# Altium project pca63557.PrjPCB (part 1 of 2)
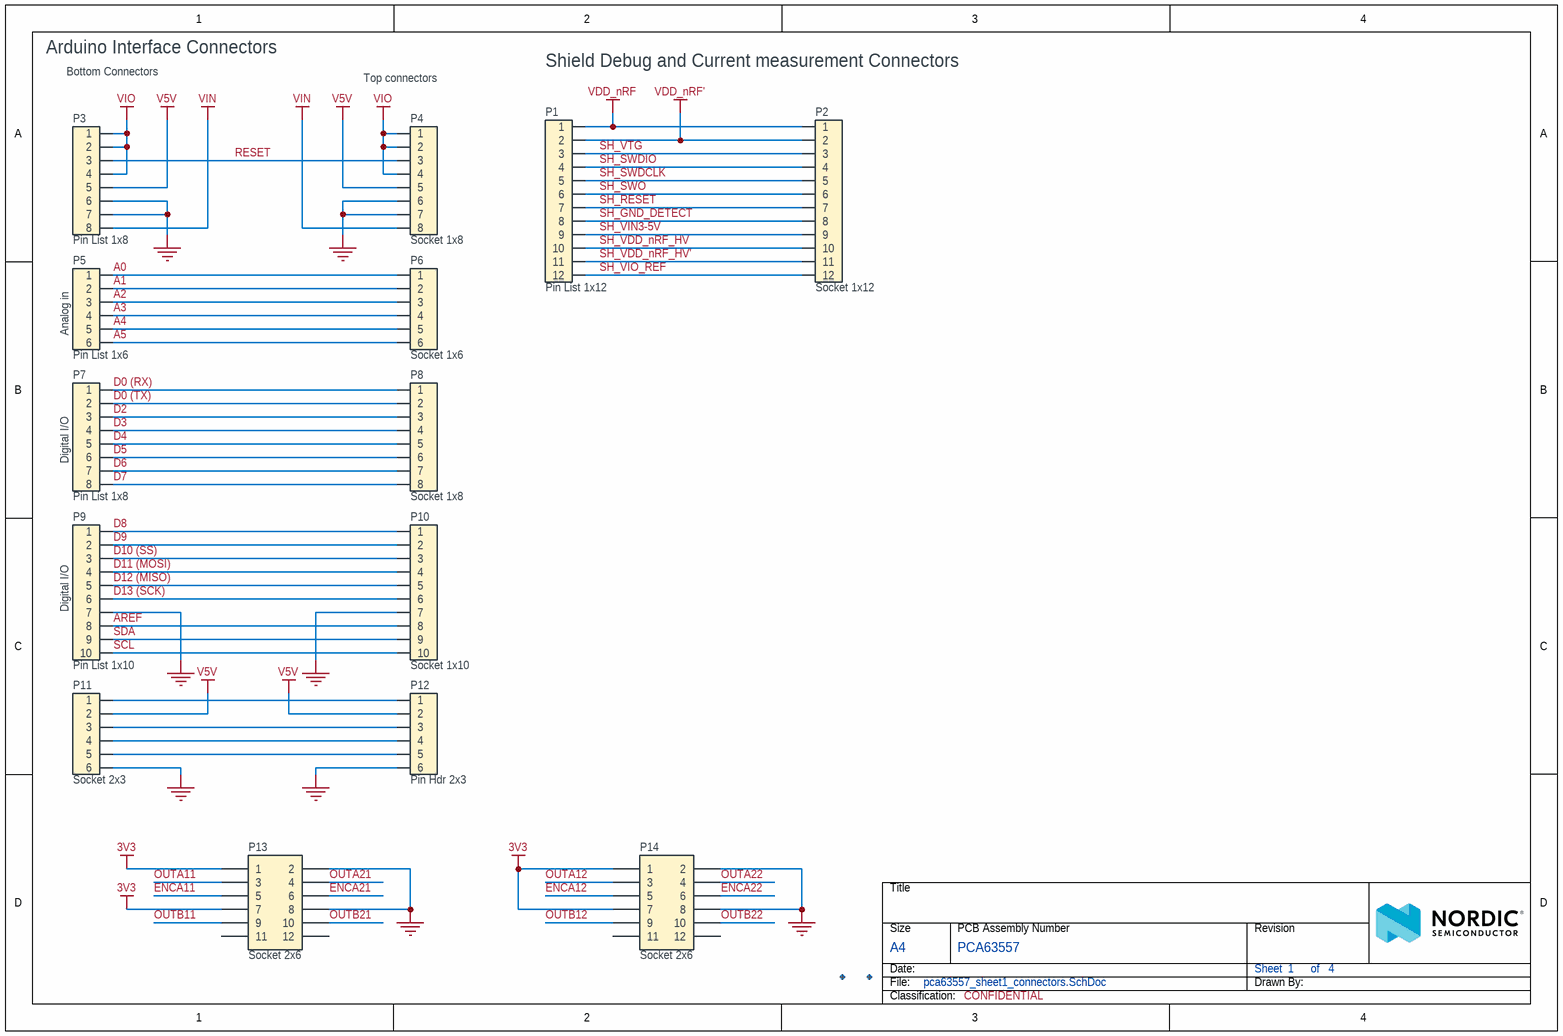
[diagram p0: pca63557_sheet1_connectors.SchDoc]
BoardThickness: 1.6mm; BoardTitle: Brushed DC Motor Driver Shield; Classification: CONFIDENTIAL; Compliance: RoHS, REACH, Halogen-Free; Designer: MAM1; Dielectric: FR-4; NrOfLayers: 4; Organization: Nordic Semiconductor; PCAName: PCA63557; PCARevision: 0.1.0; PCBNumber: 400690; PCBRevision: 0002MAM1; PCBStackup: 4001; ProjectName: Student related activities; ProjectNumber: 4435; SilkscreenColor: White; SoldermaskColor: Blue; SurfaceFinish: ENIG Gold
4 sheets, 118 parts. Net scope: global (net labels, ports and power ports of the same name join across sheets).
Board files: 400690.PcbDoc, 400690_panel.PcbDoc
Sheets:
  pca63557_sheet1_connectors.SchDoc
  pca63557_sheet2_power_supply.SchDoc
  pca63557_sheet3_motor.SchDoc
  pca63557_sheet4_misc.SchDoc

## Sheet pca63557_sheet1_connectors.SchDoc: =BoardTitle
size A4; Organization: Nordic Semiconductor; DocumentNumber: 1; Revision: 0.1.0; SheetNumber: 1; SheetTotal: 4; Author: MAM1; CompanyName: Nordic Semiconductor; DrawnBy: MAM1; DocumentSize: A4; ProjectName: Student related activities

### Parts
Fid1  Fiducial mark  [Fiducial]  (value not drawn)
Fid2  Fiducial mark  [Fiducial]  (value not drawn)
P1  Pin List 1x12  [LIST_1x12_SMD]
P2  Socket 1x12  [SOCKET_1x12_SMD]
P3  Pin List 1x8  [LIST_1x8_SMD]
P4  Socket 1x8  [SOCKET_1x8_SMD]
P5  Pin List 1x6  [LIST_1x6_SMD]
P6  Socket 1x6  [SOCKET_1x6_SMD]
P7  Pin List 1x8  [LIST_1x8_SMD]
P8  Socket 1x8  [SOCKET_1x8_SMD]
P9  Pin List 1x10  [LIST_1x10_SMD]
P10  Socket 1x10  [SOCKET_1x10_SMD]
P11  Socket 2x3  [SOCKET_2x3_SMD-2.54mm-bottom]
P12  Pin Hdr 2x3  [HDR_2x3-SMD]
P13  Socket 2x6  [SOCKET_2x6_TH_ANG_2.54]
P14  Socket 2x6  [SOCKET_2x6_TH_ANG_2.54]

### Nets
3V3: P13.1 P13.7 P14.1 P14.7
GND: P3.6 P3.7 P4.6 P4.7 P9.7 P10.7 P11.6 P12.6 P13.2 P13.8 P14.2 P14.8
SH_VIN3-5V: P1.9 P2.9
SH_VIO_REF: P1.12 P2.12
V5V: P3.5 P4.5 P11.2 P12.2
VDD_nRF: P1.1 P2.1
VDD_nRF': P1.2 P2.2
VIN: P3.8 P4.8
VIO: P3.1 P3.2 P3.4 P4.1 P4.2 P4.4
A0: P5.1 P6.1
A1: P5.2 P6.2
A2: P5.3 P6.3
A3: P5.4 P6.4
A4: P5.5 P6.5
A5: P5.6 P6.6
AREF: P9.8 P10.8
D0 (RX): P7.1 P8.1
D0 (TX): P7.2 P8.2
D2: P7.3 P8.3
D3: P7.4 P8.4
D4: P7.5 P8.5
D5: P7.6 P8.6
D6: P7.7 P8.7
D7: P7.8 P8.8
D8: P9.1 P10.1
D9: P9.2 P10.2
D10 (SS): P9.3 P10.3
D11 (MOSI): P9.4 P10.4
D12 (MISO): P9.5 P10.5
D13 (SCK): P9.6 P10.6
ENCA11: P13.5
ENCA12: P14.5
ENCA21: P13.6
ENCA22: P14.6
OUTA11: P13.3
OUTA12: P14.3
OUTA21: P13.4
OUTA22: P14.4
OUTB11: P13.9
OUTB12: P14.9
OUTB21: P13.10
OUTB22: P14.10
RESET: P3.3 P4.3
SCL: P9.10 P10.10
SDA: P9.9 P10.9
SH_GND_DETECT: P1.8 P2.8
SH_RESET: P1.7 P2.7
SH_SWDCLK: P1.5 P2.5
SH_SWDIO: P1.4 P2.4
SH_SWO: P1.6 P2.6
SH_VDD_nRF_HV: P1.10 P2.10
SH_VDD_nRF_HV': P1.11 P2.11
SH_VTG: P1.3 P2.3
NetP11_1: P11.1 P12.1
NetP11_3: P11.3 P12.3
NetP11_4: P11.4 P12.4
NetP11_5: P11.5 P12.5

Not connected (* = marked no-connect by the designer): P13 11 12; P14 11 12

### Notes on the sheet
- Arduino Interface Connectors
- Bottom Connectors
- (near P4) Top connectors
- Shield Debug and Current measurement Connectors
- (near P5) Analog in
- (near P7) Digital I/O
- (near P9) Digital I/O
- Title
- Size
- Date:
- File:
- A4
- PCB Assembly Number
- Sheet         of
- Drawn By:
- Revision
- Classification:

### Library data of the parts
Fid1 Fid2 = Fid-Mark: Manufacturer: N.A.; Part number NEMS: 100500073; Value: N.A.; Pad Count: 1; Component Status: Active; Part Number: Fid-Mark; Manufacturer Part Number: N.A.; LatestRevisionDate: 2009-12-12; Published: 2009-12-12; Note: N.A.; Artikkelnr Noca: N.A.; Footprint Doc: Fiducial; PartId: 100500073; Component Class: Connectors; Author: rsk; ComponentLink1URL: N.A.; ComponentLink1Description: Datasheet; ComponentLink2URL: N.A.; ComponentLink2Description: Supplier link; HelpURL: N.A.; Supplier 1: N.A.; Supplier Part Number 1: N.A.; Supplier 2: N.A.; Supplier Part Number 2: N.A.; Part number IPS: N.A.; Part number Norautron: N.A.
P1 = Pin List 1x12 SMD: Pin List 1x12, 2.54mm (100mil), SMD; Manufacturer: W-CON; Manufacturer Part Number: 1125-1112S0M116R2; Part number IPS: 00000009969; Part number NEMS: 100500343; Component Status: Active; Pad Count: 12; Note: N.A.; Artikkelnr Noca: 55019293; Part Number: Pin List 1x12 SMD; PartId: 100500343; Component Class: Connectors; Author: rsk; ComponentLink1URL: N.A.; ComponentLink1Description: Datasheet; ComponentLink2URL: N.A.; ComponentLink2Description: Supplier link; HelpURL: N.A.; Footprint Doc: LIST_1x12_SMD; LatestRevisionDate: 2017-10-23; Published: 2015-11-10; Value: Pin List 1x12; Supplier 1: Cabcon; Supplier Part Number 1: 1125-1112S0M116R2; Supplier 2: Samtec; Supplier Part Number 2: TSM-112-01-L-SV-P-TR; Part number Norautron: N.A.
P2 = Socket 1x12 SMD: Socket 1x12, 2.54mm (100mil), SMD; Manufacturer: W-CON; Manufacturer Part Number: 2171-112MS0CUNR1; Part number NEMS: 100500420; Component Status: Active; Pad Count: 12; Note: N.A.; Part Number: Socket 1x12 SMD; PartId: 100500420; Component Class: Connectors; Author: rsk; ComponentLink1URL: N.A.; ComponentLink1Description: Datasheet; ComponentLink2URL: N.A.; ComponentLink2Description: Supplier link; HelpURL: N.A.; Footprint Doc: SOCKET_1x12_SMD; LatestRevisionDate: 2017-10-23; Published: 2016-07-07; Value: Socket 1x12; Supplier 1: Cabcon; Supplier Part Number 1: 2171-112MS0CUNR1; Supplier 2: Samtec; Supplier Part Number 2: SSM-112-L-SV-P-TR; Artikkelnr Noca: N.A.; Part number IPS: N.A.; Part number Norautron: N.A.
P3 P7 = Pin List 1x8 SMD: Pin List 1x8, 2.54mm (100mil), SMD; Manufacturer: W-CON; Manufacturer Part Number: 1125-1108S0M116R2; Part number IPS: 00000001701; Part number NEMS: 100500329; Note: N.A.; Artikkelnr Noca: 55010006; Component Status: Active; Pad Count: 8; Part Number: Pin List 1x8 SMD; LatestRevisionDate: 2016-01-22; Published: 2016-01-22; Value: Pin List 1x8; Footprint Doc: LIST_1x8_SMD; PartId: 100500329; Component Class: Connectors; Author: rsk; ComponentLink1URL: N.A.; ComponentLink1Description: Datasheet; ComponentLink2URL: N.A.; ComponentLink2Description: Supplier link; HelpURL: \\hizz\pro\app9717\Datasheet\connectors\W-CON\1125-11XXXXMXXXXX.pdf; Supplier 1: Cabcon; Supplier Part Number 1: 1125-1108S0M116R2; Supplier 2: Samtec; Supplier Part Number 2: TSM-108-01-L-SV-P-TR; Part number Norautron: N.A.
P4 P8 = Socket 1x8 SMD: Socket 1x8, 2.54mm (100mil), SMD; Manufacturer: W-CON; Manufacturer Part Number: 2171-108MS0CUNR1; Part number IPS: 00000009963; Part number Norautron: 26032369; Part number NEMS: 100500412; Note: N.A.; Artikkelnr Noca: 55030002; Component Status: Active; Pad Count: 8; Part Number: Socket 1x8 SMD; LatestRevisionDate: 2017-10-23; Published: 2016-01-22; Value: Socket 1x8; Footprint Doc: SOCKET_1x8_SMD; PartId: 100500412; Component Class: Connectors; Author: rsk; ComponentLink1URL: N.A.; ComponentLink1Description: Datasheet; ComponentLink2URL: N.A.; ComponentLink2Description: Supplier link; HelpURL: N.A.; Supplier 1: Cabcon; Supplier Part Number 1: 2171-108MS0CUNR1; Supplier 2: Samtec; Supplier Part Number 2: SSM-108-F-SV-P-TR
P5 = Pin List 1x6 SMD: Pin List 1x6, 2.54mm (100mil), SMD; Manufacturer: W-CON; Manufacturer Part Number: 1125-1106S0M116R2; Part number NEMS: 100500320; Note: N.A.; Artikkelnr Noca: 55010026; Component Status: Active; Pad Count: 6; Part Number: Pin List 1x6 SMD; LatestRevisionDate: 2016-03-29; Published: 2016-03-29; Value: Pin List 1x6; Footprint Doc: LIST_1x6_SMD; PartId: 100500320; Component Class: Connectors; Author: rsk; ComponentLink1URL: N.A.; ComponentLink1Description: Datasheet; ComponentLink2URL: N.A.; ComponentLink2Description: Supplier link; HelpURL: \\hizz\pro\app9717\Datasheet\connectors\W-CON\1125-11XXXXMXXXXX.pdf; Supplier 1: Cabcon; Supplier Part Number 1: 1125-1106S0M116R2; Supplier 2: Samtec; Supplier Part Number 2: TSM-106-01-L-SV-P-TR; Part number IPS: N.A.; Part number Norautron: N.A.
P6 = Socket 1x6 SMD: Socket 1x6, 2.54mm (100mil), SMD; Manufacturer: W-CON; Manufacturer Part Number: 2171-106MS0CUNR1; Part number IPS: 00000009964; Part number Norautron: 26032370; Part number NEMS: 100500408; Note: N.A.; Artikkelnr Noca: 55030001; Component Status: Active; Pad Count: 6; Part Number: Socket 1x6 SMD; LatestRevisionDate: 2017-10-23; Published: 2016-01-22; Value: Socket 1x6; Footprint Doc: SOCKET_1x6_SMD; PartId: 100500408; Component Class: Connectors; Author: rsk; ComponentLink1URL: N.A.; ComponentLink1Description: Datasheet; ComponentLink2URL: N.A.; ComponentLink2Description: Supplier link; HelpURL: N.A.; Supplier 1: Cabcon; Supplier Part Number 1: 2171-106MS0CUNR1; Supplier 2: Samtec; Supplier Part Number 2: SSM-106-F-SV-P-TR
P9 = Pin List 1x10 SMD: Pin List 1x10, 2.54mm (100mil), SMD; Manufacturer: W-CON; Manufacturer Part Number: 1125-1110S0M116R2; Part number IPS: 00000004906; Part number NEMS: 100500337; Note: N.A.; Artikkelnr Noca: 55010028; Component Status: Active; Pad Count: 10; Part Number: Pin List 1x10 SMD; LatestRevisionDate: 2016-03-29; Published: 2016-03-29; Value: Pin List 1x10; Footprint Doc: LIST_1x10_SMD; PartId: 100500337; Component Class: Connectors; Author: rsk; ComponentLink1URL: N.A.; ComponentLink1Description: Datasheet; ComponentLink2URL: N.A.; ComponentLink2Description: Supplier link; HelpURL: \\hizz\pro\app9717\Datasheet\connectors\W-CON\1125-11XXXXMXXXXX.pdf; Supplier 1: Cabcon; Supplier Part Number 1: 1125-1110S0M116R2; Supplier 2: Samtec; Supplier Part Number 2: TSM-110-01-L-SV-P-TR; Part number Norautron: N.A.
P10 = Socket 1x10 SMD: Socket 1x10, 2.54mm (100mil), SMD; Manufacturer: W-CON; Manufacturer Part Number: 2171-110MS0CUNR1; Part number IPS: 00000009965; Part number Norautron: 26032371; Part number NEMS: 100500416; Note: N.A.; Artikkelnr Noca: 55030004; Component Status: Active; Pad Count: 10; Part Number: Socket 1x10 SMD; LatestRevisionDate: 2016-01-22; Published: 2016-01-22; Value: Socket 1x10; Footprint Doc: SOCKET_1x10_SMD; PartId: 100500416; Component Class: Connectors; Author: rsk; ComponentLink1URL: N.A.; ComponentLink1Description: Datasheet; ComponentLink2URL: N.A.; ComponentLink2Description: Supplier link; HelpURL: N.A.; Supplier 1: Cabcon; Supplier Part Number 1: 2171-110MS0CUNR1; Supplier 2: Samtec; Supplier Part Number 2: SSM-110-F-SV-P-TR
P11 = Socket 2x3 SMD Bottom: Socket 2x3, 2.54mm (100mil), SMD; Manufacturer: W-CON; Manufacturer Part Number: 2171-203MS0CUNR1; Part number IPS: 00000004907; Part number NEMS: 100500433; Note: N.A.; Artikkelnr Noca: 55030010; Component Status: Active; Pad Count: 6; Part Number: Socket 2x3 SMD Bottom; LatestRevisionDate: 2016-03-29; Published: 2014-06-10; Value: Socket 2x3; Footprint Doc: SOCKET_2x3_SMD-2.54mm-bottom; PartId: 100500433; Component Class: Connectors; Author: rsk; ComponentLink1URL: N.A.; ComponentLink1Description: Datasheet; ComponentLink2URL: N.A.; ComponentLink2Description: Supplier link; HelpURL: \\hizz\pro\app9717\Datasheet\connectors\W-CON\2171-2XXMXXCUNXX.pdf; Supplier 1: Cabcon; Supplier Part Number 1: 2171-203MS0CUNR1; Supplier 2: Samtec; Supplier Part Number 2: SSM-103-F-DV-P-TR; Part number Norautron: N.A.
P12 = Pin Header 2x3 SMD: Pin Header 2x3, 2.54mm (100mil) SMD; Manufacturer: W-CON; Manufacturer Part Number: 1125-1203S0M116R1; Part number IPS: 00000009966; Part number Norautron: N.A.; Part number NEMS: 100500242; Artikkelnr Noca: 55010007; Component Status: Active; Pad Count: 6; Part Number: Pin Header 2x3 SMD; LatestRevisionDate: 2016-01-22; Published: 2016-01-22; Value: Pin Hdr 2x3; Note: SMD; Footprint Doc: HDR_2x3-SMD; PartId: 100500242; Component Class: Connectors; Author: rsk; ComponentLink1URL: N.A.; ComponentLink1Description: Datasheet; ComponentLink2URL: N.A.; ComponentLink2Description: Supplier link; HelpURL: \\hizz\pro\app9717\Datasheet\connectors\W-CON\1125-12XXXXMXXXXX.PDF; Supplier 1: Cabcon; Supplier Part Number 1: 1125-1203S0M116R1; Supplier 2: Samtec; Supplier Part Number 2: TSM-103-01-L-DV
P13 P14 = Socket 2x6 SMD Right-angle: 12 Position Header Connector 0.100" (2.54mm) Through Hole, Right Angle Gold; Manufacturer: Sullins Connector Solutions; Manufacturer Part Number: PPPC062LJBN-RC; Component Status: Active; Pad Count: 12; Note: N.A.; Assembly: DNM; Part Number: Socket 2x6 SMD Right-angle; Component Class: Connectors; Author: mam1; ComponentLink1URL: https://drawings-pdf.s3.amazonaws.com/10494.pdf; ComponentLink1Description: Datasheet; ComponentLink2URL: https://www.digikey.no/no/products/detail/sullins-connector-solutions/PPPC062LJBN-RC/776017; ComponentLink2Description: Supplier link; HelpURL: N.A.; Footprint Doc: SOCKET_2x6_TH_ANG_2.54; LatestRevisionDate: 2022-06-21; Published: 2022-06-21; Value: Socket 2x6; Supplier 1: Digi-Key; Supplier Part Number 1: S5559-ND; Supplier 2: N.A.; Supplier Part Number 2: N.A.; Artikkelnr Noca: N.A.; Part number IPS: N.A.; Part number Norautron: N.A.

## Sheet pca63557_sheet2_power_supply.SchDoc: =BoardTitle
size A4; Organization: Nordic Semiconductor; DocumentNumber: 2; Revision: 0.1.0; SheetNumber: 2; SheetTotal: 4; Author: MAM1; CompanyName: Nordic Semiconductor; DrawnBy: MAM1; DocumentSize: A4; ProjectName: Student related activities
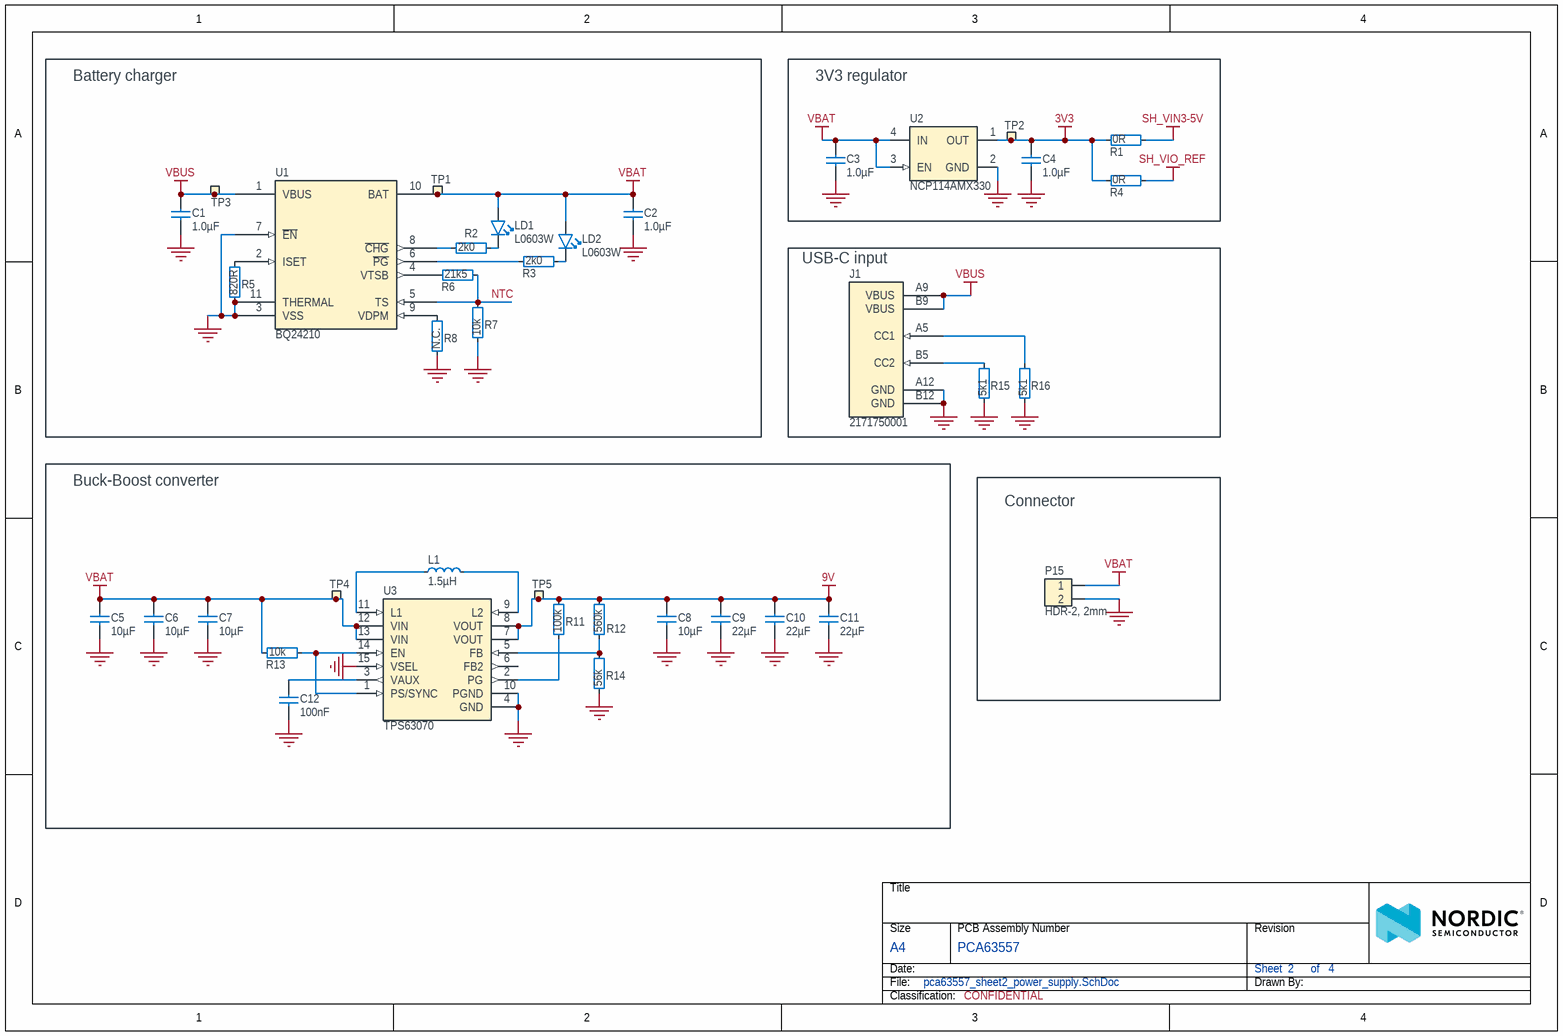
[diagram p1: pca63557_sheet2_power_supply.SchDoc]

### Parts
C1  1.0µF  [CAPC1005X04L]
C2  1.0µF  [CAPC1005X04L]
C3  1.0µF  [CAPC1005X04L]
C4  1.0µF  [CAPC1005X04L]
C5  10µF  [CAPC1608X06L]
C6  10µF  [CAPC1608X06L]
C7  10µF  [CAPC1608X06L]
C8  10µF  [CAPC1608X06L]
C9  22µF  [CAPC2012X11L]
C10  22µF  [CAPC2012X11L]
C11  22µF  [CAPC2012X11L]
C12  100nF  [CAPC1005X04L]
J1  2171750001  [2171750001]
L1  1.5µH  [XFL4020-152MEB]
LD1  L0603W  [LED_0603]
LD2  L0603W  [LED_0603]
P15  HDR-2, 2mm  [B 2B-PH-K-S]
R1  0R  [RESC1005X04L]
R2  2k0  [RESC1005X04L]
R3  2k0  [RESC1005X04L]
R4  0R  [RESC1005X04L]
R5  820R  [RESC1005X04L]
R6  21k5  [RESC1005X04L]
R7  10k  [RESC1005X04L]
R8  N.C.  [RESC1005X04L_NC]
R11  100k  [RESC1005X04L]
R12  560k  [RESC1608X06L]
R13  10k  [RESC1005X04L]
R14  56k  [RESC1608X06L]
R15  5k1  [RESC1005X04L]
R16  5k1  [RESC1005X04L]
TP1  Ø1.5mm,SMD  [TP_SMD_D1.5mm]  (value not drawn)  (no BOM)
TP2  Ø1.5mm,SMD  [TP_SMD_D1.5mm]  (value not drawn)  (no BOM)
TP3  Ø1.5mm,SMD  [TP_SMD_D1.5mm]  (value not drawn)  (no BOM)
TP4  Ø1.5mm,SMD  [TP_SMD_D1.5mm]  (value not drawn)  (no BOM)
TP5  Ø1.5mm,SMD  [TP_SMD_D1.5mm]  (value not drawn)  (no BOM)
U1  BQ24210  [BQ24210]
U2  NCP114AMX330  [UDFN65P100X100X60_HS-5N]
U3  TPS63070  [VQFN-HR50P250X300X100-15N]

### Blocks framed on the sheet
Battery charger: C1 C2 LD1 LD2 R2 R3 R5-R8 TP1 TP3 U1
3V3 regulator: C3 C4 R1 R4 TP2 U2
USB-C input: J1 R15 R16
Buck-Boost converter: C5-C12 L1 R11-R14 TP4 TP5 U3
Connector: P15

### Nets
3V3: C4.2 R1.1 R4.1 TP2.1 U2.1(OUT)
9V: C8.2 C9.2 C10.2 C11.2 R11.2 R12.2 TP5.1 U3.7(VOUT) U3.8(VOUT)
GND: C1.1 C2.1 C3.1 C4.1 C5.1 C6.1 C7.1 C8.1 C9.1 C10.1 C11.1 C12.1 J1.A12(GND) J1.B12(GND) P15.2 R5.1 R7.1 R8.1 R14.1 R15.1 R16.1 U1.3(VSS) U1.7(~{EN}) U1.11(THERMAL) U2.2(GND) U2.5(EPAD) U3.4(GND) U3.10(PGND) U3.15(VSEL)
SH_VIN3-5V: R1.2
SH_VIO_REF: R4.2
VBAT: C2.2 C3.2 C5.2 C6.2 C7.2 LD1.2(A) LD2.2(A) P15.1 R13.1 TP1.1 TP4.1 U1.10(BAT) U2.3(EN) U2.4(IN) U3.12(VIN) U3.13(VIN)
VBUS: C1.2 J1.A9(VBUS) J1.B9(VBUS) TP3.1 U1.1(VBUS)
NTC: R6.2 R7.2 U1.5(TS)
NetC12_2: C12.2 U3.3(VAUX)
NetJ1_A5: J1.A5(CC1) R16.2
NetJ1_B5: J1.B5(CC2) R15.2
NetL1_1: L1.1 U3.11(L1)
NetL1_2: L1.2 U3.9(L2)
NetLD1_1: LD1.1(C) R2.2
NetLD2_1: LD2.1(C) R3.2
NetR2_1: R2.1 U1.8(~{CHG})
NetR3_1: R3.1 U1.6(~{PG})
NetR5_2: R5.2 U1.2(ISET)
NetR6_1: R6.1 U1.4(VTSB)
NetR8_2: R8.2 U1.9(VDPM)
NetR11_1: R11.1 U3.2(PG)
NetR12_1: R12.1 R14.2 U3.5(FB)
NetR13_2: R13.2 U3.1(PS/SYNC) U3.14(EN)

Not connected (* = marked no-connect by the designer): U3 6(FB2)

### Notes on the sheet
- Title
- Size
- Date:
- File:
- A4
- PCB Assembly Number
- Sheet         of
- Drawn By:
- Revision
- Classification:

### Library data of the parts
C1 C2 = C0402-1µ0-25V-X5R: Capacitor, Ceramic, X5R, ±10%, 25V; Manufacturer: Murata; Manufacturer Part Number: GRM155R61E105KA12D; Part number NEMS: 100200453; Component Status: Active; Pad Count: 2; Artikkelnr Noca: N.A.; Part Number: C0402-1µ0-25V-X5R; PartId: 100200453; Component Class: Capacitors; Author: rsk; ComponentLink1URL: https://search.murata.co.jp/Ceramy/image/img/A01X/G101/ENG/GRM155R61E105KA12-01.pdf; ComponentLink1Description: Datasheet; ComponentLink2URL: https://www.murata.com/en-global/products/productdetail?partno=GRM155R61E105KA12%23; ComponentLink2Description: Supplier link; HelpURL: N.A.; Footprint Doc: 0402; LatestRevisionDate: 2020-12-16; Published: 2020-12-16; Value: 1.0µF; Note: 25V; Supplier 1: Digi-Key; Supplier Part Number 1: 490-10017-1-ND; Supplier 2: Mouser; Supplier Part Number 2: 81-GRM155R61E105KA2D; Part number IPS: N.A.; Part number Norautron: N.A.
C3 C4 = C0402-1µ0-10V-X5R: Capacitor, Ceramic, X5R, ±10%, 10V; Manufacturer: N.A.; Part number NEMS: 100200482; Component Status: Active; Pad Count: 2; Part Number: C0402-1µ0-10V-X5R; PartId: 100200482; Component Class: Capacitors; Author: rubr; Manufacturer Part Number: N.A.; ComponentLink1URL: N.A.; ComponentLink1Description: Datasheet; ComponentLink2URL: N.A.; ComponentLink2Description: Supplier link; HelpURL: N.A.; Footprint Doc: 0402; LatestRevisionDate: 2021-07-22; Published: 2021-07-22; Value: 1.0µF; Note: 10V; Supplier 1: N.A.; Supplier Part Number 1: N.A.; Supplier 2: N.A.; Supplier Part Number 2: N.A.; Artikkelnr Noca: N.A.; Part number IPS: N.A.; Part number Norautron: N.A.
C5-C8 = C0603-10µ-25V-X5R-CL10A106MA8NRNC: Capacitor, X5R, ±20%, 25V; Manufacturer: Samsung Electro-Mechanics America; Part number IPS: 00000009948; Part number Norautron: N.A.; Part number NEMS: 100200354; Component Status: Active; Pad Count: 2; Artikkelnr Noca: 20039436; Part Number: C0603-10µ-25V-X5R-CL10A106MA8NRNC; PartId: 100200354; Component Class: Capacitors; Author: rsk; Manufacturer Part Number: CL10A106MA8NRNC; ComponentLink1URL: N.A.; ComponentLink1Description: Datasheet; ComponentLink2URL: N.A.; ComponentLink2Description: Supplier link; HelpURL: http://www.samsungsem.com/kr/front/downloadcms.do?path=/kr/support/product-search/mlcc/__icsFiles/afieldfile/2014/11/05&fileName=S_CL10A106MA8NRNC.pdf; Footprint Doc: 0603; LatestRevisionDate: 2021-07-21; Published: 2015-04-10; Value: 10µF; Note: 25V; Supplier 1: Digi-Key; Supplier Part Number 1: 1276-1869-1-ND; Supplier 2: N.A.; Supplier Part Number 2: N.A.
C9-C11 = C0805-22µ-25V-X5R-CL21A226MAYNNWE: Capacitor, X5R, ±0.20%, 25V; Manufacturer: Samsung Electro-Mechanics; Component Status: Active; Pad Count: 2; Artikkelnr Noca: N.A.; Part Number: C0805-22µ-25V-X5R-CL21A226MAYNNWE; Component Class: Capacitors; Author: mam1; Manufacturer Part Number: CL21A226MAYNNWE; ComponentLink1URL: https://media.digikey.com/pdf/Data%20Sheets/Samsung%20PDFs/CL21A226MAYNNWE_Spec.pdfc; ComponentLink1Description: Datasheet; ComponentLink2URL: https://www.digikey.no/no/products/detail/samsung-electro-mechanics/CL21A226MAYNNWE/16344162; ComponentLink2Description: Supplier link; HelpURL: N.A.; Footprint Doc: 0805; LatestRevisionDate: 2022-06-23; Published: 2022-06-23; Value: 22µF; Note: 25V; Supplier 1: Digi-Key; Supplier Part Number 1: 1276-CL21A226MAYNNWECT-ND; Supplier 2: N.A.; Supplier Part Number 2: N.A.; Part number IPS: N.A.; Part number Norautron: N.A.
C12 = C0402-100n-50V: Capacitor, X5R, ±10%, 50V; Manufacturer: TDK Corporation; Manufacturer Part Number: C1005X5R1H104K050BB; Part number NEMS: 100200365; Component Status: Active; Pad Count: 2; Artikkelnr Noca: N.A.; Part Number: C0402-100n-50V; PartId: 100200365; Component Class: Capacitors; Author: rsk; ComponentLink1URL: N.A.; ComponentLink1Description: Datasheet; ComponentLink2URL: N.A.; ComponentLink2Description: Supplier link; HelpURL: http://www.tdk.com/pdf/TDKMLCCCapRange.pdf; Footprint Doc: 0402; LatestRevisionDate: 2020-10-13; Published: 2015-04-10; Value: 100nF; Note: 50V; Supplier 1: Digi-Key; Supplier Part Number 1: 445-5942-1-ND; Supplier 2: N.A.; Supplier Part Number 2: N.A.; Part number IPS: N.A.; Part number Norautron: N.A.
J1 = 2171750001: CONN RCP USB2.0 C 6POS SMD RA; Manufacturer: Molex; Part number NEMS: 100500750; Component Status: Active; Pad Count: 10; Note: N.A.; Supplier 1: Digi-Key; Manufacturer Part Number: 2171750001; RoHS: No; Category: Connectors; Stock 1: 6900; Pricing 1: 1000=0.50970, 2000=0.45860, 5000=0.41720, 10000=0.40300, 25000=0.38470 (USD); Part Number: 2171750001; PartId: 100500750; Component Class: Connectors; Author: mam1; ComponentLink1URL: https://www.molex.com/webdocs/datasheets/pdf/en-us/2171750001_IO_CONNECTORS.pdf; ComponentLink1Description: Datasheet; ComponentLink2URL: https://www.digikey.no/no/products/detail/molex/2171750001/13913745?s=N4IgTCBcDa4IwHZEFYAM64gLoF8g; ComponentLink2Description: Supplier link; HelpURL: N.A.; Footprint Doc: 2171750001; LatestRevisionDate: 2022-06-20; Published: 2022-06-15; Value: 2171750001; Supplier Part Number 1: 900-2171750001CT-ND; Supplier 2: N.A.; Supplier Part Number 2: N.A.; Artikkelnr Noca: N.A.; Part number IPS: N.A.; Part number Norautron: N.A.
L1 = XFL4020-152MEB: Fixed Inductors XFL4020 Low DCR Ind 1.5 uH 20 % 9.1 A; Manufacturer: Coilcraft; Part number NEMS: 100300153; Component Status: Active; Pad Count: 2; Note: N.A.; Part Number: XFL4020-152MEB; PartId: 100300153; Component Class: Inductors; Author: rsk; Manufacturer Part Number: XFL4020-152MEB; ComponentLink1URL: N.A.; ComponentLink1Description: Datasheet; ComponentLink2URL: N.A.; ComponentLink2Description: Supplier link; HelpURL: http://www.mouser.com/ds/2/597/xfl4020-270756.pdf; Footprint Doc: XFL4020-152MEB; LatestRevisionDate: 2015-09-25; Published: 2015-09-25; Value: 1.5µH; Supplier 1: Mouser; Supplier Part Number 1: 994-XFL4020-152MEB; Supplier 2: N.A.; Supplier Part Number 2: N.A.; Artikkelnr Noca: N.A.; Part number IPS: N.A.; Part number Norautron: N.A.
LD1 LD2 = 19-213/W1D: LED 0603, 19-213/W1D; Manufacturer: Everlight; Manufacturer Part Number: N.A.; Part number NEMS: 101400001; Component Status: Active; Pad Count: 2; Note: 45 mcd; Part Number: 19-213/W1D; PartId: 101400001; Component Class: Optoelectronics; Author: rsk; ComponentLink1URL: N.A.; ComponentLink1Description: Datasheet; ComponentLink2URL: N.A.; ComponentLink2Description: Supplier link; HelpURL: N.A.; Footprint Doc: 0603; LatestRevisionDate: 2009-05-18; Published: 2009-05-18; Value: L0603W; Supplier 1: N.A.; Supplier Part Number 1: N.A.; Supplier 2: N.A.; Supplier Part Number 2: N.A.; Artikkelnr Noca: N.A.; Part number IPS: N.A.; Part number Norautron: N.A.
P15 = B2B-PH-K-S: JST-B2B-PH-K-S (LF)(SN)-HEADER-BIDE ENTRY, 2WAY; Manufacturer: JST Sales America Inc.; Part number NEMS: 100500025; Component Status: Active; Pad Count: 2; Note: JST, Header; Artikkelnr Noca: N.A.; Assembly: DNM; Part Number: B2B-PH-K-S; PartId: 100500025; Component Class: Connectors; Author: rsk; Manufacturer Part Number: B2B-PH-K-S (LF)(SN); ComponentLink1URL: N.A.; ComponentLink1Description: Datasheet; ComponentLink2URL: N.A.; ComponentLink2Description: Supplier link; HelpURL: http://www.farnell.com/datasheets/80560.pdf; Footprint Doc: B 2B-PH-K-S; LatestRevisionDate: 2010-02-02; Published: 2010-02-02; Value: HDR-2, 2mm; Supplier 1: Farnell; Supplier Part Number 1: 949-1856; Supplier 2: N.A.; Supplier Part Number 2: N.A.; Part number IPS: N.A.; Part number Norautron: N.A.
R1 R4 = R0402-0R: Resistor, ±5%, 0.063W; Manufacturer: N.A.; Part number IPS: 00000007128; Part number NEMS: 100100109; Component Status: Active; Pad Count: 2; Note: Chip Res 5%; Artikkelnr Noca: 27049000; Part Number: R0402-0R; PartId: 100100109; Component Class: Resistors; Author: rsk; Manufacturer Part Number: N.A.; ComponentLink1URL: N.A.; ComponentLink1Description: Datasheet; ComponentLink2URL: N.A.; ComponentLink2Description: Supplier link; HelpURL: N.A.; Footprint Doc: 0402; LatestRevisionDate: 2009-11-23; Published: 2009-05-08; Value: 0R; Supplier 1: Farnell; Supplier Part Number 1: 146-9661; Supplier 2: N.A.; Supplier Part Number 2: N.A.; Part number Norautron: N.A.
R2 R3 = R0402-2k0: Resistor, ±1%, 0.063W; Manufacturer: N.A.; Part number NEMS: 100100181; Component Status: Active; Pad Count: 2; Note: Chip Res 1%; Artikkelnr Noca: 27049080; Part Number: R0402-2k0; PartId: 100100181; Component Class: Resistors; Author: rsk; Manufacturer Part Number: N.A.; ComponentLink1URL: N.A.; ComponentLink1Description: Datasheet; ComponentLink2URL: N.A.; ComponentLink2Description: Supplier link; HelpURL: N.A.; Footprint Doc: 0402; LatestRevisionDate: 2016-06-02; Published: 2016-05-09; Value: 2k0; Supplier 1: N.A.; Supplier Part Number 1: N.A.; Supplier 2: N.A.; Supplier Part Number 2: N.A.; Part number IPS: N.A.; Part number Norautron: N.A.
R5 = R0402-820: Resistor, ±1%, 0.063W; Manufacturer: N.A.; Part number NEMS: 100100168; Component Status: Active; Pad Count: 2; Note: Chip Res 1%; Artikkelnr Noca: 27049071; Part Number: R0402-820; PartId: 100100168; Component Class: Resistors; Author: rsk; Manufacturer Part Number: N.A.; ComponentLink1URL: N.A.; ComponentLink1Description: Datasheet; ComponentLink2URL: N.A.; ComponentLink2Description: Supplier link; HelpURL: N.A.; Footprint Doc: 0402; LatestRevisionDate: 2009-11-23; Published: 2009-05-08; Value: 820R; Supplier 1: Farnell; Supplier Part Number 1: 173-8849; Supplier 2: N.A.; Supplier Part Number 2: N.A.; Part number IPS: N.A.; Part number Norautron: N.A.
R6 = R0402-21k5: Resistor, ±1%, 0.063W; Manufacturer: N.A.; Part number NEMS: 100100211; Component Status: Active; Pad Count: 2; Note: Chip Res 1%; Part Number: R0402-21k5; PartId: 100100211; Component Class: Resistors; Author: rsk; Manufacturer Part Number: N.A.; ComponentLink1URL: N.A.; ComponentLink1Description: Datasheet; ComponentLink2URL: N.A.; ComponentLink2Description: Supplier link; HelpURL: N.A.; Footprint Doc: 0402; LatestRevisionDate: 2015-10-20; Published: 2015-10-20; Value: 21k5; Supplier 1: N.A.; Supplier Part Number 1: N.A.; Supplier 2: N.A.; Supplier Part Number 2: N.A.; Artikkelnr Noca: N.A.; Part number IPS: N.A.; Part number Norautron: N.A.
R7 R13 = R0402-10k: Resistor, ±1%, 0.063W; Manufacturer: N.A.; Part number IPS: 00000002093; Part number NEMS: 100100198; Component Status: Active; Pad Count: 2; Note: Chip Res 1%; Artikkelnr Noca: 27049097; Part Number: R0402-10k; PartId: 100100198; Component Class: Resistors; Author: rsk; Manufacturer Part Number: N.A.; ComponentLink1URL: N.A.; ComponentLink1Description: Datasheet; ComponentLink2URL: N.A.; ComponentLink2Description: Supplier link; HelpURL: N.A.; Footprint Doc: 0402; LatestRevisionDate: 2009-11-23; Published: 2009-05-08; Value: 10k; Supplier 1: Farnell; Supplier Part Number 1: 173-8864; Supplier 2: N.A.; Supplier Part Number 2: N.A.; Part number Norautron: N.A.
R8 = R0402-N.C.: Not mounted; Manufacturer: N.A.; Part number NEMS: 100100281; Component Status: Active; Pad Count: 2; Note: Chip Res; Assembly: Not mounted; Part Number: R0402-N.C.; PartId: 100100281; Component Class: Resistors; Author: rsk; Manufacturer Part Number: N.A.; ComponentLink1URL: N.A.; ComponentLink1Description: Datasheet; ComponentLink2URL: N.A.; ComponentLink2Description: Supplier link; HelpURL: N.A.; Footprint Doc: 0402; LatestRevisionDate: 2009-05-08; Published: 2009-05-08; Value: N.C.; Supplier 1: N.A.; Supplier Part Number 1: N.A.; Supplier 2: N.A.; Supplier Part Number 2: N.A.; Artikkelnr Noca: N.A.; Part number IPS: N.A.; Part number Norautron: N.A.
R11 = R0402-100k: Resistor, ±1%, 0.063W; Manufacturer: N.A.; Part number IPS: 00000003667; Part number NEMS: 100100239; Component Status: Active; Pad Count: 2; Note: Chip Res 1%; Artikkelnr Noca: 27049121; Part Number: R0402-100k; PartId: 100100239; Component Class: Resistors; Author: rsk; Manufacturer Part Number: N.A.; ComponentLink1URL: N.A.; ComponentLink1Description: Datasheet; ComponentLink2URL: N.A.; ComponentLink2Description: Supplier link; HelpURL: N.A.; Footprint Doc: 0402; LatestRevisionDate: 2009-11-23; Published: 2009-05-08; Value: 100k; Supplier 1: Farnell; Supplier Part Number 1: 173-8877; Supplier 2: N.A.; Supplier Part Number 2: N.A.; Part number Norautron: N.A.
R12 = R0603-560k: Resistor, ±1%, 0.06W; Manufacturer: N.A.; Part number NEMS: 100100357; Component Status: Active; Pad Count: 2; Note: Chip Res 1%; Artikkelnr Noca: 27069139; Part Number: R0603-560k; PartId: 100100357; Component Class: Resistors; Author: rsk; Manufacturer Part Number: N.A.; ComponentLink1URL: N.A.; ComponentLink1Description: Datasheet; ComponentLink2URL: N.A.; ComponentLink2Description: Supplier link; HelpURL: N.A.; Footprint Doc: 0603; LatestRevisionDate: 2011-08-16; Published: 2009-05-08; Value: 560k; Supplier 1: N.A.; Supplier Part Number 1: N.A.; Supplier 2: N.A.; Supplier Part Number 2: N.A.; Part number IPS: N.A.; Part number Norautron: N.A.
R14 = R0603-56k: Resistor, ±1%, 0.06W; Manufacturer: N.A.; Part number NEMS: 100100344; Component Status: Active; Pad Count: 2; Note: Chip Res 1%; Artikkelnr Noca: 27069115; Part Number: R0603-56k; PartId: 100100344; Component Class: Resistors; Author: rsk; Manufacturer Part Number: N.A.; ComponentLink1URL: N.A.; ComponentLink1Description: Datasheet; ComponentLink2URL: N.A.; ComponentLink2Description: Supplier link; HelpURL: N.A.; Footprint Doc: 0603; LatestRevisionDate: 2011-08-16; Published: 2009-05-08; Value: 56k; Supplier 1: N.A.; Supplier Part Number 1: N.A.; Supplier 2: N.A.; Supplier Part Number 2: N.A.; Part number IPS: N.A.; Part number Norautron: N.A.
R15 R16 = R0402-5k1: RES SMD 5.1K OHM 1% 1/10W 0402; Manufacturer: N.A.; Part number NEMS: 100100193; Component Status: Active; Pad Count: 2; Note: Chip Res 1%; Part Number: R0402-5k1; PartId: 100100193; Component Class: Resistors; Author: rsk; Manufacturer Part Number: N.A.; ComponentLink1URL: N.A.; ComponentLink1Description: Datasheet; ComponentLink2URL: N.A.; ComponentLink2Description: Supplier link; HelpURL: N.A.; Footprint Doc: 0402; LatestRevisionDate: 2009-04-16; Published: 2009-04-16; Value: 5k1; Supplier 1: N.A.; Supplier Part Number 1: N.A.; Supplier 2: N.A.; Supplier Part Number 2: N.A.; Artikkelnr Noca: N.A.; Part number IPS: N.A.; Part number Norautron: N.A.
TP1-TP5 = TP_SMD_Ø1.5MM: 1.5mm circular SMD testpad; Manufacturer: Nordic Semiconductor; Manufacturer Part Number: N.A.; Part number NEMS: 100500477; Component Status: Active; Pad Count: 1; Part Number: TP_SMD_Ø1.5MM; PartId: 100500477; Component Class: Connectors; Author: rsk; ComponentLink1URL: N.A.; ComponentLink1Description: Datasheet; ComponentLink2URL: N.A.; ComponentLink2Description: Supplier link; HelpURL: N.A.; Footprint Doc: TP_SMD_Ø1.5mm; LatestRevisionDate: 2021-03-05; Published: 2016-06-02; Value: Ø1.5mm,SMD; Note: N.A.; Supplier 1: N.A.; Supplier Part Number 1: N.A.; Supplier 2: N.A.; Supplier Part Number 2: N.A.; Artikkelnr Noca: N.A.; Part number IPS: N.A.; Part number Norautron: N.A.
U1 = BQ24210: IC BATT CHG LI-ION 1CELL 10WSON; Manufacturer: Texas Instruments; Component Status: Active; Pad Count: 11; Note: N.A.; Part Number: BQ24210; Component Class: Misc_ICs; Author: mam1; Manufacturer Part Number: BQ24210; ComponentLink1URL: https://www.ti.com/lit/ds/symlink/bq24210.pdf?HQS=dis-dk-null-digikeymode-dsf-pf-null-wwe&ts=1655977670459&ref_url=https%253A%252F%252Fwww.ti.com%252Fgeneral%252Fdocs%252Fsuppproductinfo.tsp%253FdistId%253D10%2526gotoUrl%253Dhttps%253A%252F%252Fwww.ti.com; ComponentLink1Description: Datasheet; ComponentLink2URL: https://www.digikey.no/no/products/detail/texas-instruments/BQ24210DQCR/2695894; ComponentLink2Description: Supplier link; HelpURL: N.A.; Footprint Doc: BQ24210; LatestRevisionDate: 2022-06-23; Published: 2022-06-21; Value: BQ24210; Supplier 1: Digi-Key; Supplier Part Number 1: 296-BQ24210DQCRCT-ND; Supplier 2: N.A.; Supplier Part Number 2: N.A.; Artikkelnr Noca: N.A.; Part number IPS: N.A.; Part number Norautron: N.A.
U2 = NCP114AMX330TBG: 300 mA CMOS Low Dropout Regulator; Manufacturer: ON Semiconductor; Part number NEMS: 101900525; Component Status: Active; Pad Count: 4; Note: N.A.; Part Number: NCP114AMX330TBG; PartId: 101900525; Component Class: Misc_ICs; Author: rsk; Manufacturer Part Number: NCP114AMX330TBG; ComponentLink1URL: http://www.onsemi.com/pub/Collateral/NCP114-D.PDF; ComponentLink1Description: Datasheet; ComponentLink2URL: N.A.; ComponentLink2Description: Supplier link; HelpURL: N.A.; Footprint Doc: UDFN-4; LatestRevisionDate: 2018-04-10; Published: 2018-04-10; Value: NCP114AMX330; Supplier 1: Digi-Key; Supplier Part Number 1: NCP114AMX330TBGOSCT-ND; Supplier 2: N.A.; Supplier Part Number 2: N.A.; Artikkelnr Noca: N.A.; Part number IPS: N.A.; Part number Norautron: N.A.
U3 = TPS63070RNMR: 2V to 16V Adjustable Buck-Boost Converter With 3.6-A Switch Current; Manufacturer: Texas Instruments; Part number NEMS: 101900487; Component Status: Active; Pad Count: 15; Note: N.A.; Part Number: TPS63070RNMR; PartId: 101900487; Component Class: Misc_ICs; Author: rsk; Manufacturer Part Number: TPS63070RNMR; ComponentLink1URL: N.A.; ComponentLink1Description: Datasheet; ComponentLink2URL: N.A.; ComponentLink2Description: Supplier link; HelpURL: http://www.ti.com/lit/ds/symlink/tps63070.pdf; Footprint Doc: VQFN-HR-15; LatestRevisionDate: 2017-06-10; Published: 2017-06-10; Value: TPS63070; Supplier 1: Digi-Key; Supplier Part Number 1: 296-44874-1-ND; Supplier 2: Mouser; Supplier Part Number 2: 595-TPS63070RNMR; Artikkelnr Noca: N.A.; Part number IPS: N.A.; Part number Norautron: N.A.

## Sheet pca63557_sheet3_motor.SchDoc: =BoardTitle
size A4; Organization: Nordic Semiconductor; DocumentNumber: 3; Revision: 0.1.0; SheetNumber: 3; SheetTotal: 4; Author: MAM1; CompanyName: Nordic Semiconductor; DrawnBy: MAM1; DocumentSize: A4; ProjectName: Student related activities
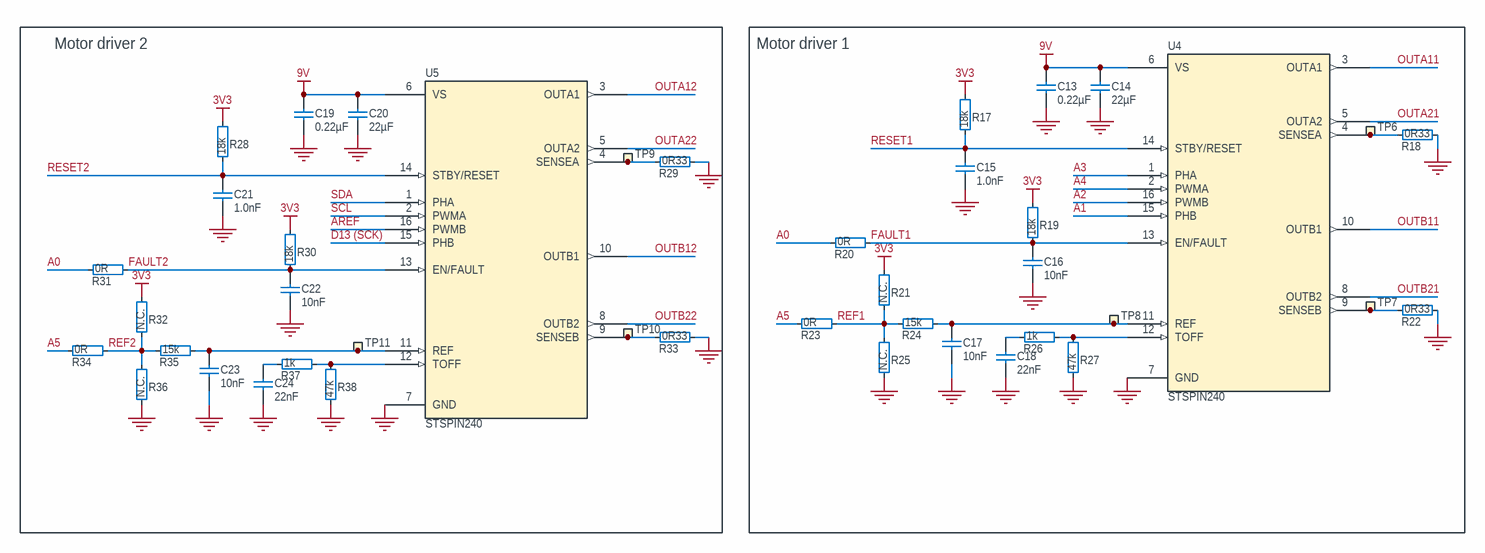
[diagram p2: pca63557_sheet3_motor.SchDoc]

### Parts
C13  0.22µF  [CAPC1005X04L]
C14  22µF  [CAPC1608X06L]
C15  1.0nF  [CAPC1005X04L]
C16  10nF  [CAPC1005X04L]
C17  10nF  [CAPC1005X04L]
C18  22nF  [CAPC1005X04L]
C19  0.22µF  [CAPC1005X04L]
C20  22µF  [CAPC1608X06L]
C21  1.0nF  [CAPC1005X04L]
C22  10nF  [CAPC1005X04L]
C23  10nF  [CAPC1005X04L]
C24  22nF  [CAPC1005X04L]
R17  18k  [RESC1005X04L]
R18  0R33  [RESC3216X08N]
R19  18k  [RESC1005X04L]
R20  0R  [RESC1005X04L]
R21  N.C.  [RESC1005X04L_NC]
R22  0R33  [RESC3216X08N]
R23  0R  [RESC1005X04L]
R24  15k  [RESC1005X04L]
R25  N.C.  [RESC1005X04L_NC]
R26  1k  [RESC1005X04L]
R27  47k  [RESC1005X04L]
R28  18k  [RESC1005X04L]
R29  0R33  [RESC3216X08N]
R30  18k  [RESC1005X04L]
R31  0R  [RESC1005X04L]
R32  N.C.  [RESC1005X04L_NC]
R33  0R33  [RESC3216X08N]
R34  0R  [RESC1005X04L]
R35  15k  [RESC1005X04L]
R36  N.C.  [RESC1005X04L_NC]
R37  1k  [RESC1005X04L]
R38  47k  [RESC1005X04L]
TP6  Ø1.5mm,SMD  [TP_SMD_D1.5mm]  (value not drawn)  (no BOM)
TP7  Ø1.5mm,SMD  [TP_SMD_D1.5mm]  (value not drawn)  (no BOM)
TP8  Ø1.5mm,SMD  [TP_SMD_D1.5mm]  (value not drawn)  (no BOM)
TP9  Ø1.5mm,SMD  [TP_SMD_D1.5mm]  (value not drawn)  (no BOM)
TP10  Ø1.5mm,SMD  [TP_SMD_D1.5mm]  (value not drawn)  (no BOM)
TP11  Ø1.5mm,SMD  [TP_SMD_D1.5mm]  (value not drawn)  (no BOM)
U4  STSPIN240  [STSPIN240]
U5  STSPIN240  [STSPIN240]

### Blocks framed on the sheet
Motor driver 2: C19-C24 R28-R38 TP9-TP11 U5
Motor driver 1: C13-C18 R17-R27 TP6-TP8 U4

### Nets
3V3: R17.2 R19.2 R21.2 R28.2 R30.2 R32.2
9V: C13.2 C14.2 C19.2 C20.2 U4.6(VS) U5.6(VS)
GND: C13.1 C14.1 C15.1 C16.1 C17.1 C18.1 C19.1 C20.1 C21.1 C22.1 C23.1 C24.1 R18.2 R22.2 R25.1 R27.1 R29.2 R33.2 R36.1 R38.1 U4.7(GND) U5.7(GND)
A0: R20.1 R31.1
A1: U4.15(PHB)
A2: U4.16(PWMB)
A3: U4.1(PHA)
A4: U4.2(PWMA)
A5: R23.1 R34.1
AREF: U5.16(PWMB)
D13 (SCK): U5.15(PHB)
FAULT1: C16.2 R19.1 R20.2 U4.13(EN/FAULT)
FAULT2: C22.2 R30.1 R31.2 U5.13(EN/FAULT)
OUTA11: U4.3(OUTA1)
OUTA12: U5.3(OUTA1)
OUTA21: U4.5(OUTA2)
OUTA22: U5.5(OUTA2)
OUTB11: U4.10(OUTB1)
OUTB12: U5.10(OUTB1)
OUTB21: U4.8(OUTB2)
OUTB22: U5.8(OUTB2)
REF1: R21.1 R23.2 R24.1 R25.2
REF2: R32.1 R34.2 R35.1 R36.2
RESET1: C15.2 R17.1 U4.14(STBY/RESET)
RESET2: C21.2 R28.1 U5.14(STBY/RESET)
SCL: U5.2(PWMA)
SDA: U5.1(PHA)
NetC17_2: C17.2 R24.2 TP8.1 U4.11(REF)
NetC18_2: C18.2 R26.1
NetC23_2: C23.2 R35.2 TP11.1 U5.11(REF)
NetC24_2: C24.2 R37.1
NetR18_1: R18.1 TP6.1 U4.4(SENSEA)
NetR22_1: R22.1 TP7.1 U4.9(SENSEB)
NetR26_2: R26.2 R27.2 U4.12(TOFF)
NetR29_1: R29.1 TP9.1 U5.4(SENSEA)
NetR33_1: R33.1 TP10.1 U5.9(SENSEB)
NetR37_2: R37.2 R38.2 U5.12(TOFF)

### Notes on the sheet
- Title
- Size
- Date:
- File:
- A4
- PCB Assembly Number
- Sheet         of
- Drawn By:
- Revision
- Classification:

### Library data of the parts
C13 C19 = C0402-0.22µ-16V-X7R-CL05B224KO5NNNC: Capacitor, X7R, ±0.10%, 16V; Manufacturer: Samsung Electro-Mechanics; Part number NEMS: 100200508; Component Status: Active; Pad Count: 2; Artikkelnr Noca: N.A.; Part Number: C0402-0.22µ-16V-X7R-CL05B224KO5NNNC; Component Class: Capacitors; Author: mam1; Manufacturer Part Number: CL05B224KO5NNNC; ComponentLink1URL: https://media.digikey.com/pdf/Data%20Sheets/Samsung%20PDFs/CL05B224KO5NNNC_Spec.pdf; ComponentLink1Description: Datasheet; ComponentLink2URL: https://www.digikey.no/en/products/detail/samsung-electro-mechanics/CL05B224KO5NNNC/3886834; ComponentLink2Description: Supplier link; HelpURL: N.A.; Footprint Doc: 0402; LatestRevisionDate: 2022-06-20; Published: 2022-06-20; Value: 0.22µF; Note: 16V; Supplier 1: Digi-Key; Supplier Part Number 1: 1276-1176-1-ND; Supplier 2: N.A.; Supplier Part Number 2: N.A.; Part number IPS: N.A.; Part number Norautron: N.A.; PartId: 100200508
C14 C20 = C0603-22µ-16V-X5R-CL10A226MO7JZNC: Capacitor, X5R, ±0.20%, 16V; Manufacturer: Samsung Electro-Mechanics; Part number NEMS: 100200507; Component Status: Active; Pad Count: 2; Artikkelnr Noca: N.A.; Part Number: C0603-22µ-16V-X5R-CL10A226MO7JZNC; Component Class: Capacitors; Author: mam1; Manufacturer Part Number: CL10A226MO7JZNC; ComponentLink1URL: https://media.digikey.com/pdf/Data%20Sheets/Samsung%20PDFs/CL10A226MO7JZNC_Spec.pdf; ComponentLink1Description: Datasheet; ComponentLink2URL: https://www.digikey.no/en/products/detail/samsung-electro-mechanics/CL10A226MO7JZNC/7320581; ComponentLink2Description: Supplier link; HelpURL: N.A.; Footprint Doc: 0603; LatestRevisionDate: 2022-06-20; Published: 2022-06-20; Value: 22µF; Note: 16V; Supplier 1: Digi-Key; Supplier Part Number 1: 1276-7076-1-ND; Supplier 2: N.A.; Supplier Part Number 2: N.A.; Part number IPS: N.A.; Part number Norautron: N.A.; PartId: 100200507
C15 C21 = C0402-1n0: Capacitor, X7R, ±10%; Manufacturer: N.A.; Part number NEMS: 100200162; Component Status: Active; Pad Count: 2; Note: 50V; Artikkelnr Noca: 20039223; Part Number: C0402-1n0; PartId: 100200162; Component Class: Capacitors; Author: rsk; Manufacturer Part Number: N.A.; ComponentLink1URL: N.A.; ComponentLink1Description: Datasheet; ComponentLink2URL: N.A.; ComponentLink2Description: Supplier link; HelpURL: N.A.; Footprint Doc: 0402; LatestRevisionDate: 2009-11-23; Published: 2009-05-08; Value: 1.0nF; Supplier 1: N.A.; Supplier Part Number 1: N.A.; Supplier 2: N.A.; Supplier Part Number 2: N.A.; Part number IPS: N.A.; Part number Norautron: N.A.
C16 C17 C22 C23 = C0402-10n: Capacitor, X7R, ±10%; Manufacturer: N.A.; Part number IPS: 00000007784; Part number NEMS: 100200173; Component Status: Active; Pad Count: 2; Note: 16V; Artikkelnr Noca: 20039166; Part Number: C0402-10n; PartId: 100200173; Component Class: Capacitors; Author: rsk; Manufacturer Part Number: N.A.; ComponentLink1URL: N.A.; ComponentLink1Description: Datasheet; ComponentLink2URL: N.A.; ComponentLink2Description: Supplier link; HelpURL: N.A.; Footprint Doc: 0402; LatestRevisionDate: 2009-11-23; Published: 2009-05-08; Value: 10nF; Supplier 1: N.A.; Supplier Part Number 1: N.A.; Supplier 2: N.A.; Supplier Part Number 2: N.A.; Part number Norautron: N.A.
C18 C24 = C0402-22n: Capacitor, X7R, ±10%; Manufacturer: N.A.; Part number NEMS: 100200177; Component Status: Active; Pad Count: 2; Note: 50V; Artikkelnr Noca: 20039316; Part Number: C0402-22n; PartId: 100200177; Component Class: Capacitors; Author: rsk; Manufacturer Part Number: N.A.; ComponentLink1URL: N.A.; ComponentLink1Description: Datasheet; ComponentLink2URL: N.A.; ComponentLink2Description: Supplier link; HelpURL: N.A.; Footprint Doc: 0402; LatestRevisionDate: 2009-05-08; Published: 2009-05-08; Value: 22nF; Supplier 1: N.A.; Supplier Part Number 1: N.A.; Supplier 2: N.A.; Supplier Part Number 2: N.A.; Part number IPS: N.A.; Part number Norautron: N.A.
R17 R19 R28 R30 = R0402-18k: Resistor, ±1%, 0.063W; Manufacturer: N.A.; Part number IPS: 00000003300; Part number NEMS: 100100208; Component Status: Active; Pad Count: 2; Note: Chip Res 1%; Artikkelnr Noca: 27049103; Part Number: R0402-18k; PartId: 100100208; Component Class: Resistors; Author: rsk; Manufacturer Part Number: N.A.; ComponentLink1URL: N.A.; ComponentLink1Description: Datasheet; ComponentLink2URL: N.A.; ComponentLink2Description: Supplier link; HelpURL: N.A.; Footprint Doc: 0402; LatestRevisionDate: 2009-11-23; Published: 2009-05-08; Value: 18k; Supplier 1: Farnell; Supplier Part Number 1: 173-8867; Supplier 2: N.A.; Supplier Part Number 2: N.A.; Part number Norautron: N.A.
R18 R22 R29 R33 = R1206-0R33-0.5%-1W-HRG3216P-3300-D-T1: 330 Ohms ±0.5% 1W Chip Resistor 1206 (3216 Metric); Manufacturer: Susumu; Part number NEMS: 100100668; Component Status: Active; Pad Count: 2; Note: 0R33 0.5% 1W; Artikkelnr Noca: N.A.; Part Number: R1206-0R33-0.5%-1W-HRG3216P-3300-D-T1; Component Class: Resistors; Author: mam1; Manufacturer Part Number: HRG3216P-3300-D-T1; ComponentLink1URL: https://www.susumu.co.jp/common/pdf/n_catalog_partition24_en.pdf; ComponentLink1Description: Datasheet; ComponentLink2URL: https://www.digikey.no/en/products/detail/susumu/HRG3216P-3300-D-T1/5762512; ComponentLink2Description: Supplier link; HelpURL: N.A.; Footprint Doc: 1206; LatestRevisionDate: 2022-06-20; Published: 2022-06-20; Value: 0R33; Supplier 1: Digi-Key; Supplier Part Number 1: 408-1913-1-ND; Supplier 2: N.A.; Supplier Part Number 2: N.A.; Part number IPS: N.A.; Part number Norautron: N.A.; PartId: 100100668
R20 R23 R31 R34 = R0402-0R: as R1 on sheet pca63557_sheet2_power_supply; Part Number: R0402-0R; PartId: 100100109; Component Class: Resistors; Author: rsk; Manufacturer Part Number: N.A.; ComponentLink1URL: N.A.; ComponentLink1Description: Datasheet; ComponentLink2URL: N.A.; ComponentLink2Description: Supplier link; HelpURL: N.A.; Footprint Doc: 0402; LatestRevisionDate: 2009-11-23; Published: 2009-05-08; Value: 0R; Supplier 1: Farnell; Supplier Part Number 1: 146-9661; Supplier 2: N.A.; Supplier Part Number 2: N.A.; Part number Norautron: N.A.
R21 R25 R32 R36 = R0402-N.C.: as R8 on sheet pca63557_sheet2_power_supply; Part Number: R0402-N.C.; PartId: 100100281; Component Class: Resistors; Author: rsk; Manufacturer Part Number: N.A.; ComponentLink1URL: N.A.; ComponentLink1Description: Datasheet; ComponentLink2URL: N.A.; ComponentLink2Description: Supplier link; HelpURL: N.A.; Footprint Doc: 0402; LatestRevisionDate: 2009-05-08; Published: 2009-05-08; Value: N.C.; Supplier 1: N.A.; Supplier Part Number 1: N.A.; Supplier 2: N.A.; Supplier Part Number 2: N.A.; Artikkelnr Noca: N.A.; Part number IPS: N.A.; Part number Norautron: N.A.
R24 R35 = R0402-15k: Resistor, ±1%, 0.063W; Manufacturer: N.A.; Part number IPS: 00000002098; Part number NEMS: 100100206; Component Status: Active; Pad Count: 2; Note: Chip Res 1%; Artikkelnr Noca: 27049101; Part Number: R0402-15k; PartId: 100100206; Component Class: Resistors; Author: rsk; Manufacturer Part Number: N.A.; ComponentLink1URL: N.A.; ComponentLink1Description: Datasheet; ComponentLink2URL: N.A.; ComponentLink2Description: Supplier link; HelpURL: N.A.; Footprint Doc: 0402; LatestRevisionDate: 2009-11-23; Published: 2009-05-08; Value: 15k; Supplier 1: Farnell; Supplier Part Number 1: 173-8866; Supplier 2: N.A.; Supplier Part Number 2: N.A.; Part number Norautron: N.A.
R26 R37 = R0402-1k0: Resistor, ±1%, 0.063W; Manufacturer: N.A.; Part number IPS: 00000002218; Part number NEMS: 100100171; Component Status: Active; Pad Count: 2; Note: Chip Res 1%; Artikkelnr Noca: 27049073; Part Number: R0402-1k0; PartId: 100100171; Component Class: Resistors; Author: rsk; Manufacturer Part Number: N.A.; ComponentLink1URL: N.A.; ComponentLink1Description: Datasheet; ComponentLink2URL: N.A.; ComponentLink2Description: Supplier link; HelpURL: N.A.; Footprint Doc: 0402; LatestRevisionDate: 2009-11-23; Published: 2009-05-08; Value: 1k; Supplier 1: Farnell; Supplier Part Number 1: 173-8850; Supplier 2: N.A.; Supplier Part Number 2: N.A.; Part number Norautron: N.A.
R27 R38 = R0402-47k: Resistor, ±1%, 0.063W; Manufacturer: N.A.; Part number NEMS: 100100224; Component Status: Active; Pad Count: 2; Note: Chip Res 1%; Artikkelnr Noca: 27049113; Part Number: R0402-47k; PartId: 100100224; Component Class: Resistors; Author: rsk; Manufacturer Part Number: N.A.; ComponentLink1URL: N.A.; ComponentLink1Description: Datasheet; ComponentLink2URL: N.A.; ComponentLink2Description: Supplier link; HelpURL: N.A.; Footprint Doc: 0402; LatestRevisionDate: 2009-11-23; Published: 2009-05-08; Value: 47k; Supplier 1: Farnell; Supplier Part Number 1: 146-9719; Supplier 2: N.A.; Supplier Part Number 2: N.A.; Part number IPS: N.A.; Part number Norautron: N.A.
TP6-TP11 = TP_SMD_Ø1.5MM: as TP1 on sheet pca63557_sheet2_power_supply; Part Number: TP_SMD_Ø1.5MM; PartId: 100500477; Component Class: Connectors; Author: rsk; ComponentLink1URL: N.A.; ComponentLink1Description: Datasheet; ComponentLink2URL: N.A.; ComponentLink2Description: Supplier link; HelpURL: N.A.; Footprint Doc: TP_SMD_Ø1.5mm; LatestRevisionDate: 2021-03-05; Published: 2016-06-02; Value: Ø1.5mm,SMD; Note: N.A.; Supplier 1: N.A.; Supplier Part Number 1: N.A.; Supplier 2: N.A.; Supplier Part Number 2: N.A.; Artikkelnr Noca: N.A.; Part number IPS: N.A.; Part number Norautron: N.A.
U4 U5 = STSPIN240: LOW VOLTAGE DUAL BRUSH DC MOTOR; Manufacturer: STMicroelectronics; Part number NEMS: 101900705; Component Status: Active; Pad Count: 17; Note: N.A.; Supplier 1: Digi-Key; Manufacturer Part Number: STSPIN240; ComponentLink1URL: https://www.st.com/content/ccc/resource/technical/document/datasheet/group3/2f/ef/09/12/89/cd/41/c8/DM00293532/files/DM00293532.pdf/jcr:content/translations/en.DM00293532.pdf; ComponentLink1Description: Datasheet; ComponentLink2URL: https://www.digikey.no/no/products/detail/stmicroelectronics/STSPIN240/6137576?s=N4IgTCBcDaIM4Bc4AcCWA7MAWADCAugL5A; ComponentLink2Description: Supplier link; Supplier Part Number 1: 497-16604-1-ND; Part Number: STSPIN240; PartId: 101900705; Component Class: Misc_ICs; Author: mam1; HelpURL: N.A.; Footprint Doc: STSPIN240; LatestRevisionDate: 2022-06-20; Published: 2022-06-15; Value: STSPIN240; Supplier 2: N.A.; Supplier Part Number 2: N.A.; Artikkelnr Noca: N.A.; Part number IPS: N.A.; Part number Norautron: N.A.